# Altium schematic sheet FPGA_POWER.SchDoc
size B
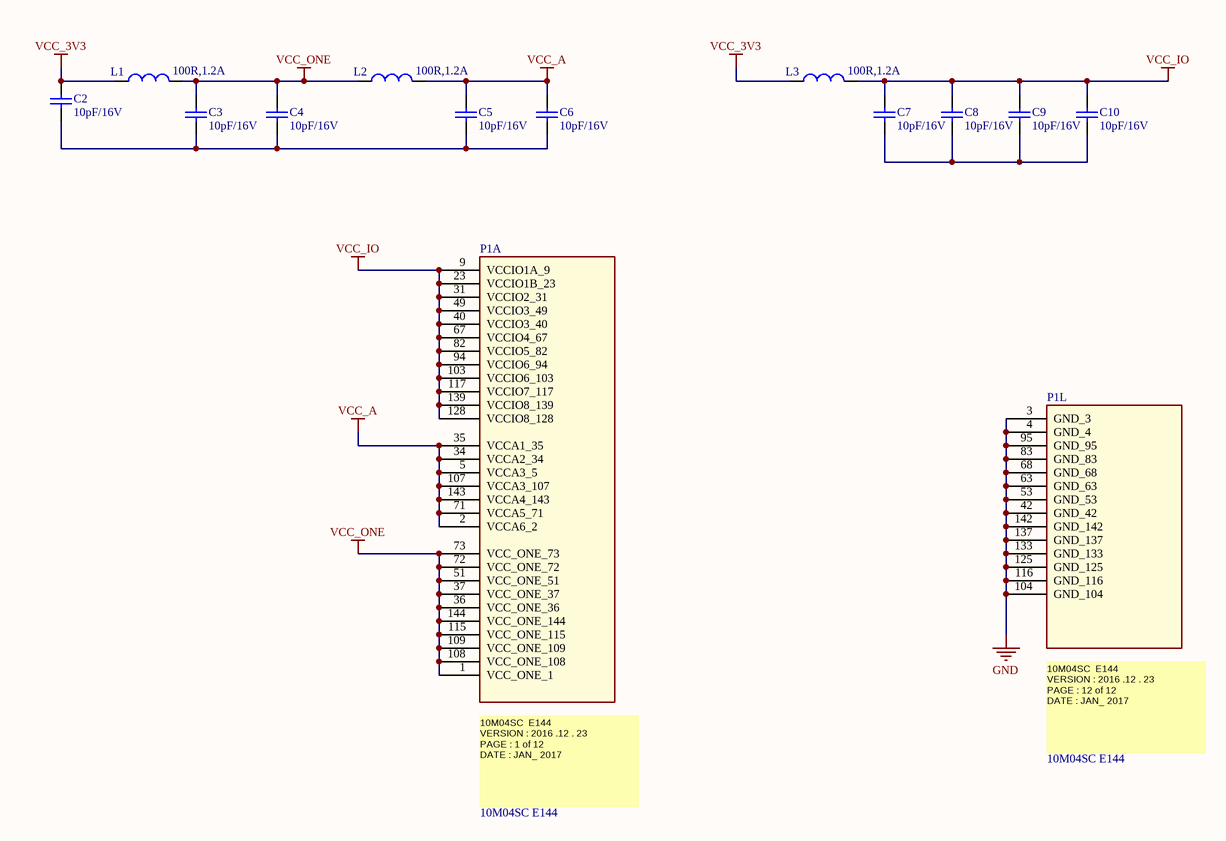
[diagram p0: FPGA_POWER.SchDoc]

## Parts
C2  10pF/16V  [RAD-0.3]
C3  10pF/16V  [RAD-0.3]
C4  10pF/16V  [RAD-0.3]
C5  10pF/16V  [RAD-0.3]
C6  10pF/16V  [RAD-0.3]
C7  10pF/16V  [RAD-0.3]
C8  10pF/16V  [RAD-0.3]
C9  10pF/16V  [RAD-0.3]
C10  10pF/16V  [RAD-0.3]
L1  100R,1.2A  [0603_IND]
L2  100R,1.2A  [0603_IND]
L3  100R,1.2A  [0603_IND]
P1  10M04SC E144  (parts A,L of 12)

## Nets
GND: P1.3(GND_3) P1.4(GND_4) P1.42(GND_42) P1.53(GND_53) P1.63(GND_63) P1.68(GND_68) P1.83(GND_83) P1.95(GND_95) P1.104(GND_104) P1.116(GND_116) P1.125(GND_125) P1.133(GND_133) P1.137(GND_137) P1.142(GND_142)
VCC_3V3: C2.1 L1.1 L3.1
VCC_A: C5.1 C6.1 L2.2 P1.2(VCCA6_2) P1.5(VCCA3_5) P1.34(VCCA2_34) P1.35(VCCA1_35) P1.71(VCCA5_71) P1.107(VCCA3_107) P1.143(VCCA4_143)
VCC_IO: C7.1 C8.1 C9.1 C10.1 L3.2 P1.9(VCCIO1A_9) P1.23(VCCIO1B_23) P1.31(VCCIO2_31) P1.40(VCCIO3_40) P1.49(VCCIO3_49) P1.67(VCCIO4_67) P1.82(VCCIO5_82) P1.94(VCCIO6_94) P1.103(VCCIO6_103) P1.117(VCCIO7_117) P1.128(VCCIO8_128) P1.139(VCCIO8_139)
VCC_ONE: C3.1 C4.1 L1.2 L2.1 P1.1(VCC_ONE_1) P1.36(VCC_ONE_36) P1.37(VCC_ONE_37) P1.51(VCC_ONE_51) P1.72(VCC_ONE_72) P1.73(VCC_ONE_73) P1.108(VCC_ONE_108) P1.109(VCC_ONE_109) P1.115(VCC_ONE_115) P1.144(VCC_ONE_144)
NetC2_2: C2.2 C3.2 C4.2 C5.2 C6.2
NetC7_2: C7.2 C8.2 C9.2 C10.2

## Notes on the sheet
- (in symbol 10M04SC E144, part A) 10M04SC  E144 / VERSION : 2016 .12 . 23 / PAGE : 1 of 12 / DATE : JAN_ 2017 /
- (in symbol 10M04SC E144, part L) 10M04SC  E144 / VERSION : 2016 .12 . 23 / PAGE : 12 of 12 / DATE : JAN_ 2017 /

## Library data of the parts
C2-C10 = Cap: Capacitor; Published: 8-Jun-2000; LatestRevisionDate: 17-Jul-2002; LatestRevisionNote: Re-released for DXP Platform.; PackageReference: RAD-0.3; Publisher: Altium Limited; PackageDescription: Radial Cap, Thru-Hole; 2 Leads; 0.3 in Pin Spacing; Value: 10pF/16V
L1-L3 = 0805_IND: Ferrite Beads 100ohms 1A 60mOhms 0603 Ferrite Chip; Manufacturer: TDK; Mfr Part No: MPZ1608D101BTA00; Value: 100R/1A; Package: 0603; Stockiest Part No: 810-MPZ1608D101BTA00; Stockiest: MOUSER
P1 = 10M04SC E144: SPLIT_INST: TRUE; SWAP_INFO: (S1+S2+S3+S4+S5+S6+S7+S8+S9+S10+S11+S12)